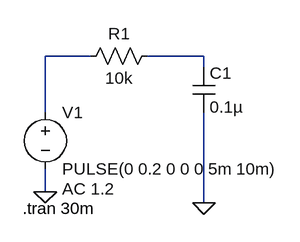
[diagram p0: schematic volt divid 2nd one.asc]
volt divid 2nd one.asc, the LTspice schematic file:
Version 4
SHEET 1 880 680
WIRE 112 80 48 80
WIRE 272 80 192 80
WIRE 272 96 272 80
WIRE 48 160 48 80
WIRE 48 272 48 240
WIRE 272 288 272 160
FLAG 48 272 0
FLAG 272 288 0
SYMBOL voltage 48 144 R0
WINDOW 123 24 124 Left 2
WINDOW 39 0 0 Left 0
SYMATTR Value2 AC 1.2
SYMATTR InstName V1
SYMATTR Value PULSE(0 0.2 0 0 0 5m 10m)
SYMBOL res 208 64 R90
WINDOW 0 0 56 VBottom 2
WINDOW 3 32 56 VTop 2
SYMATTR InstName R1
SYMATTR Value 10k
SYMBOL cap 256 96 R0
SYMATTR InstName C1
SYMATTR Value 0.1µ
TEXT 16 296 Left 2 !.tran 30m

The netlist it stands for:
* volt divid 2nd one.asc
V1 N001 0 PULSE(0 0.2 0 0 0 5m 10m) AC 1.2
R1 N002 N001 10k
C1 N002 0 0.1µ
.tran 30m
.backanno
.end